# Altium project miniTop.PrjPcb
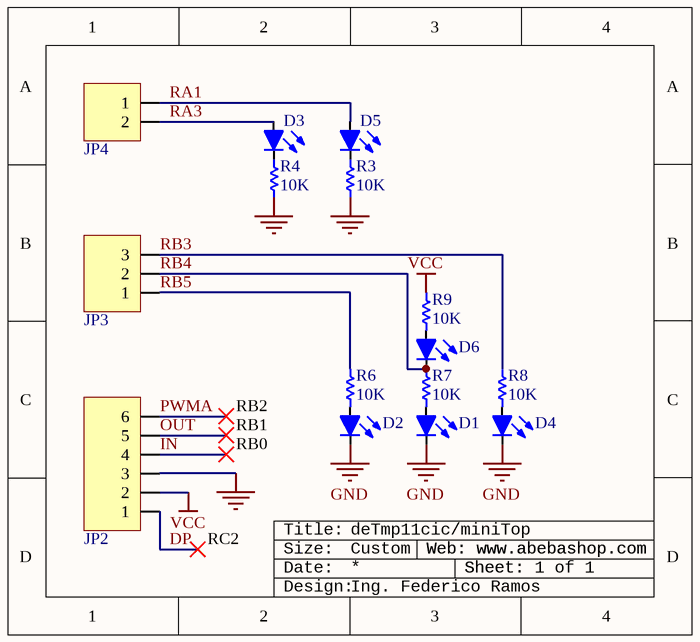
[diagram p0: miniTop.SchDoc]
1 sheet, 16 parts. Net scope: global (net labels, ports and power ports of the same name join across sheets).
Board file: miniTop.PcbDoc

## Sheet miniTop.SchDoc: DE:TMP:11:MINI:TOP
size 91 x 83 mm; SheetNumber: 1; SheetTotal: 1; VersionFGR: 20220721; WebFGR: www.abebashop.com; PageSetup: Record=PageOptions|CenterHorizontal=True|CenterVertical=True|PrintScale=2.47|XCorrection=1.00|YCorrection=1.00|PrintKind=0|BorderSize=5000000|LeftOffset=0|BottomOffset=0|Orientation=2|PaperLength=1000|PaperWidth=1000|Scale=100|PaperSource=7|PrintQuality=-4|MediaType=1|DitherType=10|PaperKind=A4|PrintScaleMode=1; ModifiedDate: 21-07-2022

### Parts
D1  Led 5mm Rojo Difuso  [LED_1206]  (value not drawn)
D2  Led 5mm Rojo Difuso  [LED_1206]  (value not drawn)
D3  Led 5mm Rojo Difuso  [LED_1206]  (value not drawn)
D4  Led 5mm Rojo Difuso  [LED_1206]  (value not drawn)
D5  Led 5mm Rojo Difuso  [LED_1206]  (value not drawn)
D6  Led 5mm Rojo Difuso  [LED_1206]  (value not drawn)
JP2  Header6x1  [HDR6x1_FEMALE]  (value not drawn)
JP3  Header3x1  [HDR3x1_FEMALE]  (value not drawn)
JP4  Header2x1  [HDR2x1_FEMALE]  (value not drawn)
R3  Resistencia: 10K  [R1206]  (hidden comment: Resistencia 1206; 10Kohm)
R4  Resistencia: 10K  [R1206]  (hidden comment: Resistencia 1206; 10Kohm)
R6  Resistencia: 10K  [R1206]  (hidden comment: Resistencia 1206; 10Kohm)
R7  Resistencia: 10K  [R1206]  (hidden comment: Resistencia 1206; 10Kohm)
R8  Resistencia: 10K  [R1206]  (hidden comment: Resistencia 1206; 10Kohm)
R9  Resistencia: 10K  [R1206]  (hidden comment: Resistencia 1206; 10Kohm)
ROT?  Rotulo  (value not drawn)  (graphical)

### Nets
GND: D1.2(K) D2.2(K) D4.2(K) JP2.3 R3.1 R4.1
VCC: JP2.2 R9.2
DP: JP2.1
IN: JP2.4
OUT: JP2.5
PWMA: JP2.6
RA1: D5.1(A) JP4.1
RA3: D3.1(A) JP4.2
RB3: JP3.3 R8.2
RB4: D6.2(K) JP3.2 R7.2
RB5: JP3.1 R6.2
NetD1_1: D1.1(A) R7.1
NetD2_1: D2.1(A) R6.1
NetD3_2: D3.2(K) R4.2
NetD4_1: D4.1(A) R8.1
NetD5_2: D5.2(K) R3.2
NetD6_1: D6.1(A) R9.1

### Notes on the sheet
- RB2
- RB1
- RB0
- (near JP2) RC2
- deTmp11cic/miniTop
- Custom
- (near ROT?) Web: www.abebashop.com
- Sheet: 1 of 1
- Ing. Federico Ramos
- (in symbol Rotulo) Title:; Size:; Web: www.abebashop.com; Date:; Sheet:; Design:

### Library data of the parts
D1-D6 = Led 5mm Rojo Difuso: Codigo Ebay: NA; Dolares Ebay: 0.06
JP2 = Header6x1: Header 6x1; Price: ?
JP3 = Header3x1: Header 3x1; Price: ?
JP4 = Header2x1: Header 2x1; Price: ?
R3 R4 R6-R9 = Resistencia 1206; 10Kohm: Codigo Elemon: RS3886245; Dolares Elemon: 0.00718
ROT? = Rotulo: Rotulo [consolas]